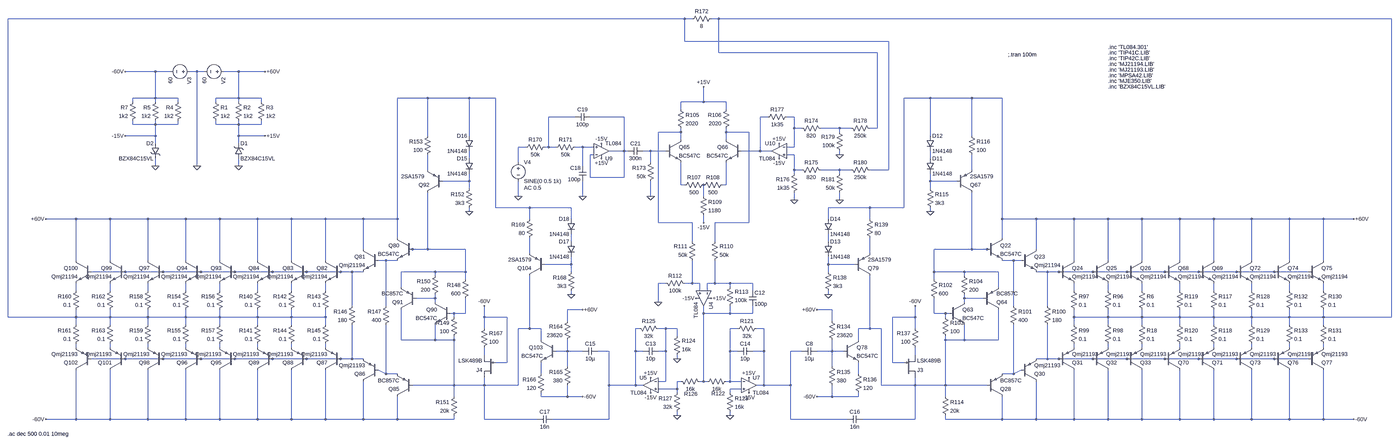
[diagram p0: schematic testV9_3.asc, whole sheet]
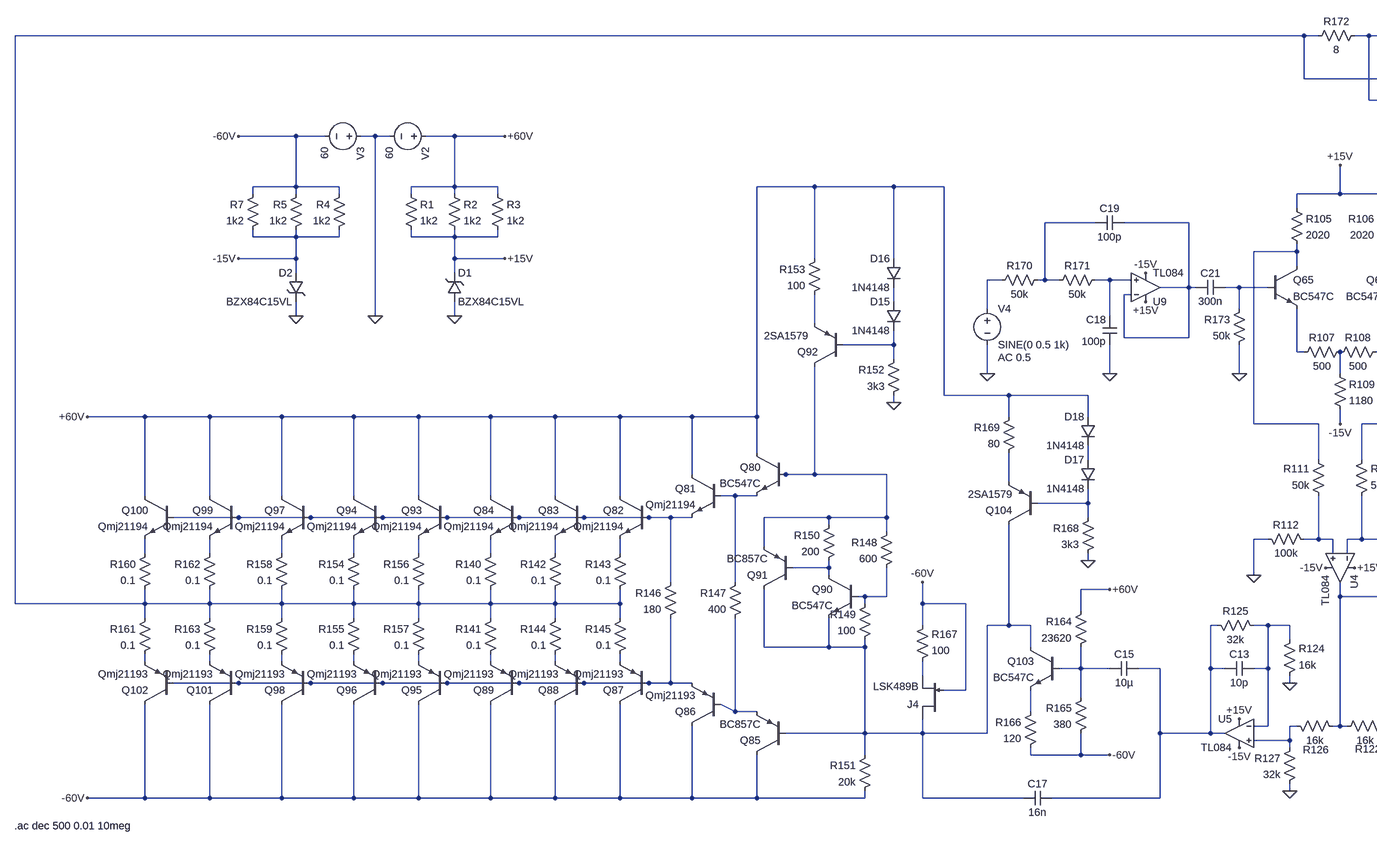
[diagram p1: schematic testV9_3.asc, part, row 1 of 1, column 1 of 2]
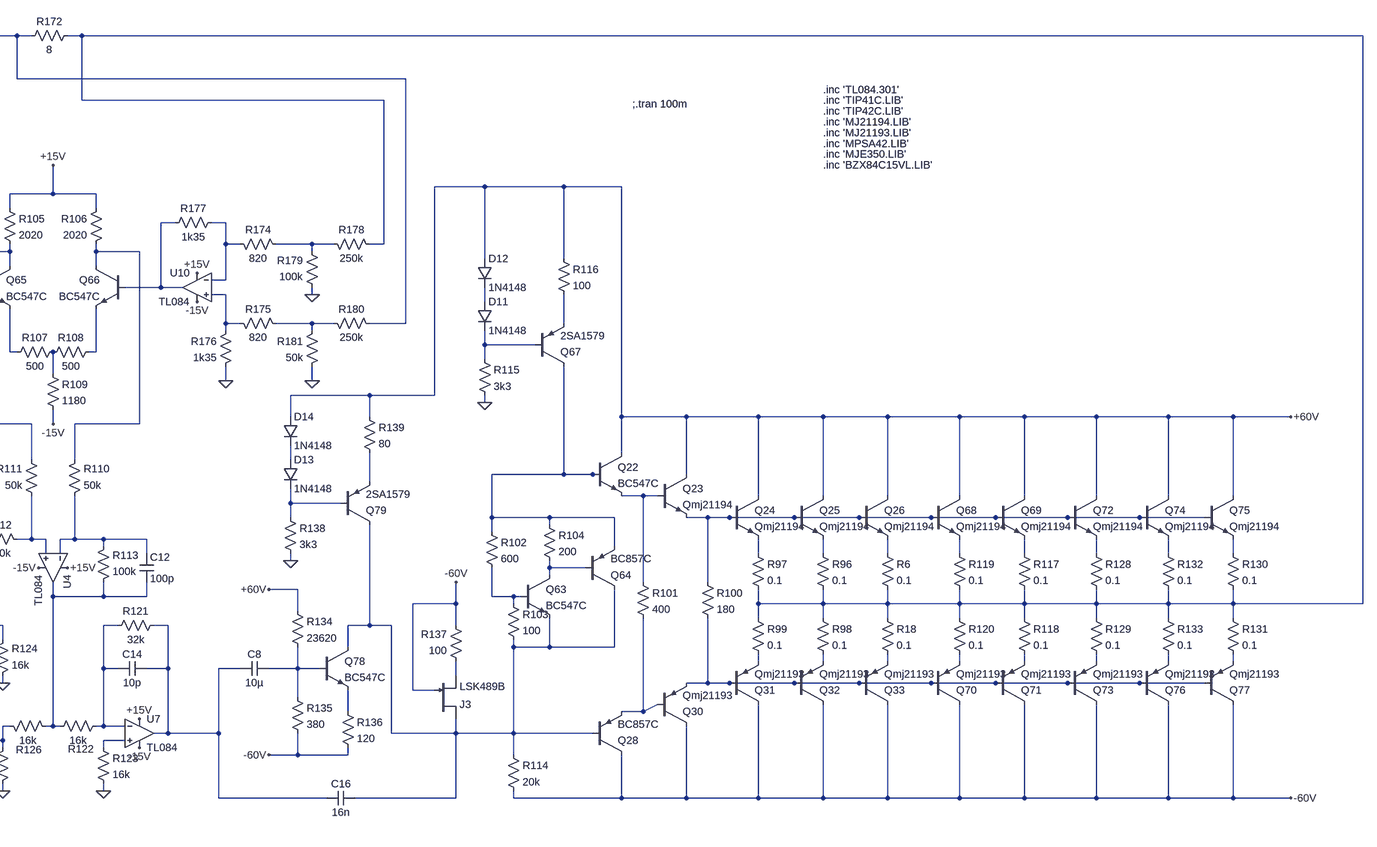
[diagram p2: schematic testV9_3.asc, part, row 1 of 1, column 2 of 2]
testV9_3.asc, the LTspice schematic file:
Version 4
SHEET 1 16980 7392
WIRE 7632 4208 4768 4208
WIRE 7664 4208 7632 4208
WIRE 7776 4208 7744 4208
WIRE 10624 4208 7776 4208
WIRE 7632 4304 7632 4208
WIRE 8496 4304 7632 4304
WIRE 7776 4352 7776 4208
WIRE 8448 4352 7776 4352
WIRE 5392 4432 5264 4432
WIRE 5456 4432 5392 4432
WIRE 5568 4432 5536 4432
WIRE 5600 4432 5568 4432
WIRE 5744 4432 5680 4432
WIRE 5856 4432 5744 4432
WIRE 5392 4544 5392 4432
WIRE 5392 4544 5296 4544
WIRE 5488 4544 5392 4544
WIRE 5744 4544 5744 4432
WIRE 5744 4544 5648 4544
WIRE 5840 4544 5744 4544
WIRE 6544 4544 6416 4544
WIRE 6720 4544 6544 4544
WIRE 6832 4544 6720 4544
WIRE 8672 4544 8560 4544
WIRE 8848 4544 8672 4544
WIRE 8976 4544 8848 4544
WIRE 5296 4560 5296 4544
WIRE 5392 4560 5392 4544
WIRE 5488 4560 5488 4544
WIRE 5648 4560 5648 4544
WIRE 5744 4560 5744 4544
WIRE 5840 4560 5840 4544
WIRE 7712 4560 7712 4496
WIRE 7712 4560 7616 4560
WIRE 7808 4560 7712 4560
WIRE 7616 4592 7616 4560
WIRE 7808 4592 7808 4560
WIRE 7168 4624 7056 4624
WIRE 7376 4624 7232 4624
WIRE 7984 4624 7952 4624
WIRE 8096 4624 8064 4624
WIRE 5296 4656 5296 4640
WIRE 5392 4656 5392 4640
WIRE 5392 4656 5296 4656
WIRE 5488 4656 5488 4640
WIRE 5488 4656 5392 4656
WIRE 5648 4656 5648 4640
WIRE 5744 4656 5744 4640
WIRE 5744 4656 5648 4656
WIRE 5840 4656 5840 4640
WIRE 5840 4656 5744 4656
WIRE 8096 4672 8096 4624
WIRE 8128 4672 8096 4672
WIRE 8288 4672 8208 4672
WIRE 8336 4672 8288 4672
WIRE 8448 4672 8448 4352
WIRE 8448 4672 8416 4672
WIRE 7616 4688 7616 4672
WIRE 7616 4688 7520 4688
WIRE 7808 4688 7808 4672
WIRE 7904 4688 7808 4688
WIRE 8288 4688 8288 4672
WIRE 5392 4704 5392 4656
WIRE 5392 4704 5264 4704
WIRE 5744 4704 5744 4656
WIRE 5856 4704 5744 4704
WIRE 6544 4704 6544 4544
WIRE 6720 4704 6720 4544
WIRE 8672 4704 8672 4544
WIRE 8848 4704 8848 4544
WIRE 7616 4720 7616 4688
WIRE 7808 4720 7808 4688
WIRE 5392 4736 5392 4704
WIRE 5744 4736 5744 4704
WIRE 6960 4752 6928 4752
WIRE 7056 4752 7056 4624
WIRE 7056 4752 7040 4752
WIRE 7088 4752 7056 4752
WIRE 7200 4752 7168 4752
WIRE 7248 4752 7200 4752
WIRE 8096 4752 8096 4672
WIRE 8096 4752 8064 4752
WIRE 7376 4768 7376 4624
WIRE 7376 4768 7312 4768
WIRE 7392 4768 7376 4768
WIRE 7488 4768 7456 4768
WIRE 7552 4768 7488 4768
WIRE 7952 4768 7952 4624
WIRE 7952 4768 7872 4768
WIRE 8000 4768 7952 4768
WIRE 7248 4784 7232 4784
WIRE 8096 4784 8064 4784
WIRE 8288 4784 8288 4768
WIRE 6720 4800 6720 4768
WIRE 8672 4800 8672 4768
WIRE 6928 4816 6928 4752
WIRE 7488 4816 7488 4768
WIRE 5392 4832 5392 4800
WIRE 5568 4832 5568 4432
WIRE 5744 4832 5744 4800
WIRE 7200 4832 7200 4752
WIRE 6544 4848 6544 4784
WIRE 8096 4848 8096 4784
WIRE 8128 4848 8096 4848
WIRE 8288 4848 8208 4848
WIRE 8336 4848 8288 4848
WIRE 8496 4848 8496 4304
WIRE 8496 4848 8416 4848
WIRE 8848 4848 8848 4784
WIRE 8096 4864 8096 4848
WIRE 8288 4864 8288 4848
WIRE 7232 4880 7232 4784
WIRE 7376 4880 7376 4768
WIRE 7376 4880 7232 4880
WIRE 6720 4896 6720 4864
WIRE 6720 4896 6608 4896
WIRE 8672 4896 8672 4864
WIRE 8784 4896 8672 4896
WIRE 7616 4912 7616 4816
WIRE 7632 4912 7616 4912
WIRE 7808 4912 7808 4816
WIRE 7808 4912 7792 4912
WIRE 6720 4928 6720 4896
WIRE 8672 4928 8672 4896
WIRE 6928 4960 6928 4896
WIRE 7200 4960 7200 4896
WIRE 7488 4960 7488 4896
WIRE 7712 4960 7712 4912
WIRE 8096 4976 8096 4944
WIRE 8288 4976 8288 4944
WIRE 6832 5008 6832 4544
WIRE 6976 5008 6832 5008
WIRE 7152 5008 6976 5008
WIRE 8416 5008 8240 5008
WIRE 8560 5008 8560 4544
WIRE 8560 5008 8416 5008
WIRE 6720 5024 6720 5008
WIRE 8672 5024 8672 5008
WIRE 5056 5056 4928 5056
WIRE 5200 5056 5056 5056
WIRE 5360 5056 5200 5056
WIRE 5520 5056 5360 5056
WIRE 5664 5056 5520 5056
WIRE 5824 5056 5664 5056
WIRE 5968 5056 5824 5056
WIRE 6112 5056 5968 5056
WIRE 6272 5056 6112 5056
WIRE 6416 5056 6416 4544
WIRE 6416 5056 6272 5056
WIRE 6976 5056 6976 5008
WIRE 7152 5056 7152 5008
WIRE 8240 5056 8240 5008
WIRE 8416 5056 8416 5008
WIRE 8976 5056 8976 4544
WIRE 9120 5056 8976 5056
WIRE 9280 5056 9120 5056
WIRE 9424 5056 9280 5056
WIRE 9568 5056 9424 5056
WIRE 9728 5056 9568 5056
WIRE 9872 5056 9728 5056
WIRE 10032 5056 9872 5056
WIRE 10192 5056 10032 5056
WIRE 10336 5056 10192 5056
WIRE 10464 5056 10336 5056
WIRE 7520 5072 7520 4688
WIRE 7664 5072 7520 5072
WIRE 7712 5072 7712 5040
WIRE 7904 5072 7904 4688
WIRE 7904 5072 7760 5072
WIRE 6416 5136 6416 5056
WIRE 8976 5136 8976 5056
WIRE 7152 5152 7152 5120
WIRE 7664 5152 7664 5072
WIRE 7760 5152 7760 5072
WIRE 8240 5152 8240 5120
WIRE 6272 5184 6272 5056
WIRE 6480 5184 6464 5184
WIRE 6544 5184 6544 4944
WIRE 6544 5184 6480 5184
WIRE 6704 5184 6544 5184
WIRE 8848 5184 8848 4944
WIRE 8848 5184 8688 5184
WIRE 8912 5184 8848 5184
WIRE 8928 5184 8912 5184
WIRE 9120 5184 9120 5056
WIRE 6976 5200 6976 5136
WIRE 8416 5200 8416 5136
WIRE 5056 5232 5056 5056
WIRE 5200 5232 5200 5056
WIRE 5360 5232 5360 5056
WIRE 5520 5232 5520 5056
WIRE 5664 5232 5664 5056
WIRE 5824 5232 5824 5056
WIRE 5968 5232 5968 5056
WIRE 6112 5232 6112 5056
WIRE 6368 5232 6336 5232
WIRE 6416 5232 6368 5232
WIRE 9024 5232 8976 5232
WIRE 9056 5232 9024 5232
WIRE 9280 5232 9280 5056
WIRE 9424 5232 9424 5056
WIRE 9568 5232 9568 5056
WIRE 9728 5232 9728 5056
WIRE 9872 5232 9872 5056
WIRE 10032 5232 10032 5056
WIRE 10192 5232 10192 5056
WIRE 10336 5232 10336 5056
WIRE 7152 5248 7152 5216
WIRE 7152 5248 7040 5248
WIRE 8240 5248 8240 5216
WIRE 8352 5248 8240 5248
WIRE 5264 5280 5120 5280
WIRE 5424 5280 5264 5280
WIRE 5584 5280 5424 5280
WIRE 5728 5280 5584 5280
WIRE 5888 5280 5728 5280
WIRE 6032 5280 5888 5280
WIRE 6176 5280 6032 5280
WIRE 6224 5280 6176 5280
WIRE 6272 5280 6224 5280
WIRE 6576 5280 6432 5280
WIRE 6704 5280 6704 5184
WIRE 6704 5280 6576 5280
WIRE 7152 5280 7152 5248
WIRE 8240 5280 8240 5248
WIRE 8688 5280 8688 5184
WIRE 8816 5280 8688 5280
WIRE 8960 5280 8816 5280
WIRE 9168 5280 9120 5280
WIRE 9216 5280 9168 5280
WIRE 9360 5280 9216 5280
WIRE 9504 5280 9360 5280
WIRE 9664 5280 9504 5280
WIRE 9808 5280 9664 5280
WIRE 9968 5280 9808 5280
WIRE 10128 5280 9968 5280
WIRE 10272 5280 10128 5280
WIRE 6576 5296 6576 5280
WIRE 8816 5296 8816 5280
WIRE 6704 5312 6704 5280
WIRE 8688 5312 8688 5280
WIRE 7552 5328 7520 5328
WIRE 7664 5328 7664 5232
WIRE 7664 5328 7632 5328
WIRE 7696 5328 7664 5328
WIRE 7760 5328 7760 5232
WIRE 7760 5328 7728 5328
WIRE 7824 5328 7760 5328
WIRE 7920 5328 7824 5328
WIRE 6432 5344 6432 5280
WIRE 7824 5344 7824 5328
WIRE 8960 5344 8960 5280
WIRE 5056 5360 5056 5328
WIRE 5200 5360 5200 5328
WIRE 5360 5360 5360 5328
WIRE 5520 5360 5520 5328
WIRE 5664 5360 5664 5328
WIRE 5824 5360 5824 5328
WIRE 5968 5360 5968 5328
WIRE 6112 5360 6112 5328
WIRE 7696 5360 7696 5328
WIRE 7728 5360 7728 5328
WIRE 7920 5360 7920 5328
WIRE 9280 5360 9280 5328
WIRE 9424 5360 9424 5328
WIRE 9568 5360 9568 5328
WIRE 9728 5360 9728 5328
WIRE 9872 5360 9872 5328
WIRE 10032 5360 10032 5328
WIRE 10192 5360 10192 5328
WIRE 10336 5360 10336 5328
WIRE 7152 5376 7152 5360
WIRE 8240 5376 8240 5360
WIRE 6576 5392 6576 5376
WIRE 6576 5392 6496 5392
WIRE 8816 5392 8816 5376
WIRE 8896 5392 8816 5392
WIRE 6576 5408 6576 5392
WIRE 7520 5408 7520 5328
WIRE 8816 5408 8816 5392
WIRE 6224 5424 6224 5280
WIRE 6368 5424 6368 5232
WIRE 9024 5424 9024 5232
WIRE 9168 5424 9168 5280
WIRE 7200 5440 7136 5440
WIRE 8256 5440 8192 5440
WIRE 6656 5456 6640 5456
WIRE 6704 5456 6704 5392
WIRE 6704 5456 6656 5456
WIRE 7712 5456 7712 5424
WIRE 7824 5456 7824 5424
WIRE 7824 5456 7712 5456
WIRE 7920 5456 7920 5424
WIRE 7920 5456 7824 5456
WIRE 8688 5456 8688 5392
WIRE 8736 5456 8688 5456
WIRE 8752 5456 8736 5456
WIRE 4768 5472 4768 4208
WIRE 5056 5472 5056 5440
WIRE 5056 5472 4768 5472
WIRE 5200 5472 5200 5440
WIRE 5200 5472 5056 5472
WIRE 5360 5472 5360 5440
WIRE 5360 5472 5200 5472
WIRE 5520 5472 5520 5440
WIRE 5520 5472 5360 5472
WIRE 5664 5472 5664 5440
WIRE 5664 5472 5520 5472
WIRE 5824 5472 5824 5440
WIRE 5824 5472 5664 5472
WIRE 5968 5472 5968 5440
WIRE 5968 5472 5824 5472
WIRE 6112 5472 6112 5440
WIRE 6112 5472 5968 5472
WIRE 6656 5472 6656 5456
WIRE 6784 5472 6784 5424
WIRE 6880 5472 6784 5472
WIRE 8608 5472 8608 5424
WIRE 8608 5472 8512 5472
WIRE 8736 5472 8736 5456
WIRE 9280 5472 9280 5440
WIRE 9424 5472 9424 5440
WIRE 9424 5472 9280 5472
WIRE 9568 5472 9568 5440
WIRE 9568 5472 9424 5472
WIRE 9728 5472 9728 5440
WIRE 9728 5472 9568 5472
WIRE 9872 5472 9872 5440
WIRE 9872 5472 9728 5472
WIRE 10032 5472 10032 5440
WIRE 10032 5472 9872 5472
WIRE 10192 5472 10192 5440
WIRE 10192 5472 10032 5472
WIRE 10336 5472 10336 5440
WIRE 10336 5472 10192 5472
WIRE 10624 5472 10624 4208
WIRE 10624 5472 10336 5472
WIRE 7136 5488 7136 5440
WIRE 8256 5488 8256 5440
WIRE 5056 5504 5056 5472
WIRE 5200 5504 5200 5472
WIRE 5360 5504 5360 5472
WIRE 5520 5504 5520 5472
WIRE 5664 5504 5664 5472
WIRE 5824 5504 5824 5472
WIRE 5968 5504 5968 5472
WIRE 6112 5504 6112 5472
WIRE 9280 5504 9280 5472
WIRE 9424 5504 9424 5472
WIRE 9568 5504 9568 5472
WIRE 9728 5504 9728 5472
WIRE 9872 5504 9872 5472
WIRE 10032 5504 10032 5472
WIRE 10192 5504 10192 5472
WIRE 10336 5504 10336 5472
WIRE 6784 5520 6784 5472
WIRE 6976 5520 6976 5296
WIRE 6976 5520 6928 5520
WIRE 7024 5520 6976 5520
WIRE 7440 5520 7424 5520
WIRE 7552 5520 7520 5520
WIRE 7600 5520 7552 5520
WIRE 7856 5520 7824 5520
WIRE 7968 5520 7936 5520
WIRE 8416 5520 8416 5296
WIRE 8416 5520 8368 5520
WIRE 8464 5520 8416 5520
WIRE 8608 5520 8608 5472
WIRE 7600 5552 7600 5520
WIRE 6432 5568 6432 5440
WIRE 6576 5568 6576 5504
WIRE 6576 5568 6432 5568
WIRE 6656 5568 6656 5552
WIRE 6656 5568 6576 5568
WIRE 7024 5568 7024 5520
WIRE 8368 5568 8368 5520
WIRE 8736 5568 8736 5552
WIRE 8816 5568 8816 5504
WIRE 8816 5568 8736 5568
WIRE 8960 5568 8960 5440
WIRE 8960 5568 8816 5568
WIRE 5056 5600 5056 5584
WIRE 5200 5600 5200 5584
WIRE 5360 5600 5360 5584
WIRE 5520 5600 5520 5584
WIRE 5664 5600 5664 5584
WIRE 5824 5600 5824 5584
WIRE 5968 5600 5968 5584
WIRE 6112 5600 6112 5584
WIRE 9280 5600 9280 5584
WIRE 9424 5600 9424 5584
WIRE 9568 5600 9568 5584
WIRE 9728 5600 9728 5584
WIRE 9872 5600 9872 5584
WIRE 10032 5600 10032 5584
WIRE 10192 5600 10192 5584
WIRE 10336 5600 10336 5584
WIRE 7136 5616 7136 5568
WIRE 7136 5616 7088 5616
WIRE 7200 5616 7136 5616
WIRE 7312 5616 7264 5616
WIRE 7424 5616 7424 5520
WIRE 7456 5616 7424 5616
WIRE 7552 5616 7552 5520
WIRE 7552 5616 7520 5616
WIRE 7824 5616 7824 5520
WIRE 7856 5616 7824 5616
WIRE 7968 5616 7968 5520
WIRE 7968 5616 7920 5616
WIRE 8128 5616 8080 5616
WIRE 8256 5616 8256 5568
WIRE 8256 5616 8192 5616
WIRE 8304 5616 8256 5616
WIRE 6784 5632 6784 5600
WIRE 8608 5632 8608 5600
WIRE 5264 5648 5120 5648
WIRE 5424 5648 5264 5648
WIRE 5584 5648 5424 5648
WIRE 5728 5648 5584 5648
WIRE 5888 5648 5728 5648
WIRE 6032 5648 5888 5648
WIRE 6176 5648 6032 5648
WIRE 6224 5648 6224 5504
WIRE 6224 5648 6176 5648
WIRE 6272 5648 6224 5648
WIRE 7600 5648 7600 5632
WIRE 9168 5648 9168 5504
WIRE 9168 5648 9120 5648
WIRE 9216 5648 9168 5648
WIRE 9360 5648 9216 5648
WIRE 9504 5648 9360 5648
WIRE 9664 5648 9504 5648
WIRE 9808 5648 9664 5648
WIRE 9968 5648 9808 5648
WIRE 10128 5648 9968 5648
WIRE 10272 5648 10128 5648
WIRE 6880 5664 6880 5472
WIRE 6880 5664 6832 5664
WIRE 8512 5664 8512 5472
WIRE 8560 5664 8512 5664
WIRE 7136 5680 7136 5616
WIRE 8256 5680 8256 5616
WIRE 6368 5712 6368 5504
WIRE 6368 5712 6336 5696
WIRE 6416 5712 6368 5712
WIRE 7024 5712 7024 5664
WIRE 8368 5712 8368 5664
WIRE 9024 5712 9024 5504
WIRE 9024 5712 9056 5696
WIRE 9024 5712 8976 5712
WIRE 7552 5744 7552 5616
WIRE 7552 5744 7520 5744
WIRE 7616 5744 7600 5744
WIRE 7712 5744 7712 5456
WIRE 7712 5744 7696 5744
WIRE 7728 5744 7712 5744
WIRE 7824 5744 7824 5616
WIRE 7824 5744 7808 5744
WIRE 7872 5744 7824 5744
WIRE 6656 5760 6656 5568
WIRE 6656 5760 6480 5760
WIRE 6784 5760 6784 5728
WIRE 6784 5760 6656 5760
WIRE 6928 5760 6928 5520
WIRE 6928 5760 6784 5760
WIRE 7312 5760 7312 5616
WIRE 7424 5760 7424 5616
WIRE 7424 5760 7312 5760
WIRE 7456 5760 7424 5760
WIRE 7968 5760 7968 5616
WIRE 7968 5760 7936 5760
WIRE 8080 5760 8080 5616
WIRE 8080 5760 7968 5760
WIRE 8464 5760 8464 5520
WIRE 8608 5760 8608 5728
WIRE 8608 5760 8464 5760
WIRE 8736 5760 8736 5568
WIRE 8736 5760 8608 5760
WIRE 8912 5760 8736 5760
WIRE 7600 5776 7600 5744
WIRE 7600 5776 7520 5776
WIRE 7872 5776 7824 5776
WIRE 7600 5792 7600 5776
WIRE 7824 5792 7824 5776
WIRE 6656 5808 6656 5760
WIRE 7024 5808 7024 5792
WIRE 7136 5808 7136 5760
WIRE 7136 5808 7024 5808
WIRE 7200 5808 7136 5808
WIRE 8256 5808 8256 5760
WIRE 8256 5808 8192 5808
WIRE 8368 5808 8368 5792
WIRE 8368 5808 8256 5808
WIRE 8736 5808 8736 5760
WIRE 7600 5888 7600 5872
WIRE 7824 5888 7824 5872
WIRE 5056 5904 5056 5696
WIRE 5056 5904 4928 5904
WIRE 5200 5904 5200 5696
WIRE 5200 5904 5056 5904
WIRE 5360 5904 5360 5696
WIRE 5360 5904 5200 5904
WIRE 5520 5904 5520 5696
WIRE 5520 5904 5360 5904
WIRE 5664 5904 5664 5696
WIRE 5664 5904 5520 5904
WIRE 5824 5904 5824 5696
WIRE 5824 5904 5664 5904
WIRE 5968 5904 5968 5696
WIRE 5968 5904 5824 5904
WIRE 6112 5904 6112 5696
WIRE 6112 5904 5968 5904
WIRE 6272 5904 6272 5744
WIRE 6272 5904 6112 5904
WIRE 6416 5904 6416 5808
WIRE 6416 5904 6272 5904
WIRE 6656 5904 6656 5888
WIRE 6656 5904 6416 5904
WIRE 6784 5904 6784 5760
WIRE 7008 5904 6784 5904
WIRE 7312 5904 7312 5760
WIRE 7312 5904 7072 5904
WIRE 8080 5904 8080 5760
WIRE 8320 5904 8080 5904
WIRE 8608 5904 8608 5760
WIRE 8608 5904 8384 5904
WIRE 8736 5904 8736 5888
WIRE 8976 5904 8976 5808
WIRE 8976 5904 8736 5904
WIRE 9120 5904 9120 5744
WIRE 9120 5904 8976 5904
WIRE 9280 5904 9280 5696
WIRE 9280 5904 9120 5904
WIRE 9424 5904 9424 5696
WIRE 9424 5904 9280 5904
WIRE 9568 5904 9568 5696
WIRE 9568 5904 9424 5904
WIRE 9728 5904 9728 5696
WIRE 9728 5904 9568 5904
WIRE 9872 5904 9872 5696
WIRE 9872 5904 9728 5904
WIRE 10032 5904 10032 5696
WIRE 10032 5904 9872 5904
WIRE 10192 5904 10192 5696
WIRE 10192 5904 10032 5904
WIRE 10336 5904 10336 5696
WIRE 10336 5904 10192 5904
WIRE 10464 5904 10336 5904
FLAG 5568 4832 0
FLAG 5856 4432 +60V
FLAG 5264 4432 -60V
FLAG 7712 5072 -15V
FLAG 7680 5392 -15V
FLAG 7712 4496 +15V
FLAG 7744 5392 +15V
FLAG 8672 5024 0
FLAG 7520 5408 0
FLAG 7824 5888 0
FLAG 7600 5648 0
FLAG 7600 5888 0
FLAG 7904 5792 -15V
FLAG 7488 5792 -15V
FLAG 7488 5728 +15V
FLAG 7904 5728 +15V
FLAG 8192 5440 +60V
FLAG 8192 5808 -60V
FLAG 8240 5376 0
FLAG 10464 5904 -60V
FLAG 10464 5056 +60V
FLAG 6720 5024 0
FLAG 7200 5440 +60V
FLAG 7200 5808 -60V
FLAG 7152 5376 0
FLAG 4928 5904 -60V
FLAG 4928 5056 +60V
FLAG 6928 4960 0
FLAG 7200 4960 0
FLAG 7280 4800 +15V
FLAG 7280 4736 -15V
FLAG 7488 4960 0
FLAG 8032 4800 -15V
FLAG 8032 4736 +15V
FLAG 8288 4784 0
FLAG 8288 4976 0
FLAG 8096 4976 0
FLAG 8608 5424 -60V
FLAG 6784 5424 -60V
FLAG 5744 4832 0
FLAG 5392 4832 0
FLAG 5856 4704 +15V
FLAG 5264 4704 -15V
SYMBOL voltage 5696 4432 R90
WINDOW 123 0 0 Left 0
WINDOW 39 24 44 Left 2
SYMATTR InstName V2
SYMATTR Value 60
SYMBOL voltage 5552 4432 R90
WINDOW 123 0 0 Left 0
WINDOW 39 24 124 Left 2
SYMATTR InstName V3
SYMATTR Value 60
SYMBOL npn 8912 5136 R0
SYMATTR InstName Q22
SYMATTR Value BC547C
SYMBOL npn 9056 5184 R0
SYMATTR InstName Q23
SYMATTR Value Qmj21194
SYMBOL npn 9216 5232 R0
SYMATTR InstName Q24
SYMATTR Value Qmj21194
SYMBOL npn 9360 5232 R0
SYMATTR InstName Q25
SYMATTR Value Qmj21194
SYMBOL npn 9504 5232 R0
SYMATTR InstName Q26
SYMATTR Value Qmj21194
SYMBOL pnp 8912 5808 M180
SYMATTR InstName Q28
SYMATTR Value BC857C
SYMBOL pnp 9056 5744 M180
SYMATTR InstName Q30
SYMATTR Value Qmj21193
SYMBOL pnp 9216 5696 M180
SYMATTR InstName Q31
SYMATTR Value Qmj21193
SYMBOL pnp 9360 5696 M180
SYMATTR InstName Q32
SYMATTR Value Qmj21193
SYMBOL pnp 9504 5696 M180
SYMATTR InstName Q33
SYMATTR Value Qmj21193
SYMBOL res 9552 5344 R0
SYMATTR InstName R6
SYMATTR Value 0.1
SYMBOL res 9552 5488 R0
SYMATTR InstName R18
SYMATTR Value 0.1
SYMBOL res 9408 5344 R0
SYMATTR InstName R96
SYMATTR Value 0.1
SYMBOL res 9264 5344 R0
SYMATTR InstName R97
SYMATTR Value 0.1
SYMBOL res 9408 5488 R0
SYMATTR InstName R98
SYMATTR Value 0.1
SYMBOL res 9264 5488 R0
SYMATTR InstName R99
SYMATTR Value 0.1
SYMBOL res 9152 5408 R0
SYMATTR InstName R100
SYMATTR Value 180
SYMBOL res 9008 5408 R0
SYMATTR InstName R101
SYMATTR Value 400
SYMBOL npn 8752 5408 R0
SYMATTR InstName Q63
SYMATTR Value BC547C
SYMBOL res 8672 5296 R0
SYMATTR InstName R102
SYMATTR Value 600
SYMBOL res 8720 5456 R0
SYMATTR InstName R103
SYMATTR Value 100
SYMBOL res 8800 5280 R0
SYMATTR InstName R104
SYMATTR Value 200
SYMBOL pnp 8896 5440 M180
SYMATTR InstName Q64
SYMATTR Value BC857C
SYMBOL npn 7552 4720 R0
SYMATTR InstName Q65
SYMATTR Value BC547C
SYMBOL npn 7872 4720 M0
SYMATTR InstName Q66
SYMATTR Value BC547C
SYMBOL res 7600 4576 R0
SYMATTR InstName R105
SYMATTR Value 2020
SYMBOL res 7824 4576 M0
SYMATTR InstName R106
SYMATTR Value 2020
SYMBOL res 7728 4896 R90
WINDOW 0 0 56 VBottom 2
WINDOW 3 32 56 VTop 2
SYMATTR InstName R107
SYMATTR Value 500
SYMBOL res 7808 4896 R90
WINDOW 0 0 56 VBottom 2
WINDOW 3 32 56 VTop 2
SYMATTR InstName R108
SYMATTR Value 500
SYMBOL res 7696 4944 R0
SYMATTR InstName R109
SYMATTR Value 1180
SYMBOL Opamps\\opamp2 7776 5392 R90
SYMATTR InstName U4
SYMATTR Value TL084
SYMBOL res 7744 5248 M180
WINDOW 0 36 76 Left 2
WINDOW 3 36 40 Left 2
SYMATTR InstName R110
SYMATTR Value 50k
SYMBOL res 7680 5248 R180
WINDOW 0 36 76 Left 2
WINDOW 3 36 40 Left 2
SYMATTR InstName R111
SYMATTR Value 50k
SYMBOL res 7648 5344 M270
WINDOW 0 32 56 VTop 2
WINDOW 3 0 56 VBottom 2
SYMATTR InstName R112
SYMATTR Value 100k
SYMBOL res 7808 5440 M180
WINDOW 0 36 76 Left 2
WINDOW 3 36 40 Left 2
SYMATTR InstName R113
SYMATTR Value 100k
SYMBOL res 8720 5792 R0
SYMATTR InstName R114
SYMATTR Value 20k
SYMBOL pnp 8784 4944 M180
SYMATTR InstName Q67
SYMATTR Value 2SA1579
SYMBOL res 8656 4912 R0
SYMATTR InstName R115
SYMATTR Value 3k3
SYMBOL diode 8656 4800 R0
SYMATTR InstName D11
SYMATTR Value 1N4148
SYMBOL diode 8656 4704 R0
SYMATTR InstName D12
SYMATTR Value 1N4148
SYMBOL res 8832 4688 R0
SYMATTR InstName R116
SYMATTR Value 100
SYMBOL npn 9664 5232 R0
SYMATTR InstName Q68
SYMATTR Value Qmj21194
SYMBOL npn 9808 5232 R0
SYMATTR InstName Q69
SYMATTR Value Qmj21194
SYMBOL pnp 9664 5696 M180
SYMATTR InstName Q70
SYMATTR Value Qmj21193
SYMBOL pnp 9808 5696 M180
SYMATTR InstName Q71
SYMATTR Value Qmj21193
SYMBOL res 9856 5344 R0
SYMATTR InstName R117
SYMATTR Value 0.1
SYMBOL res 9856 5488 R0
SYMATTR InstName R118
SYMATTR Value 0.1
SYMBOL res 9712 5344 R0
SYMATTR InstName R119
SYMATTR Value 0.1
SYMBOL res 9712 5488 R0
SYMATTR InstName R120
SYMATTR Value 0.1
SYMBOL res 7952 5504 R90
WINDOW 0 0 56 VBottom 2
WINDOW 3 32 56 VTop 2
SYMATTR InstName R121
SYMATTR Value 32k
SYMBOL res 7824 5728 R90
WINDOW 0 83 50 VBottom 2
WINDOW 3 32 56 VTop 2
SYMATTR InstName R122
SYMATTR Value 16k
SYMBOL res 7808 5776 R0
SYMATTR InstName R123
SYMATTR Value 16k
SYMBOL res 7584 5648 M180
WINDOW 0 36 76 Left 2
WINDOW 3 36 40 Left 2
SYMATTR InstName R124
SYMATTR Value 16k
SYMBOL res 7424 5504 M90
WINDOW 0 0 56 VBottom 2
WINDOW 3 32 56 VTop 2
SYMATTR InstName R125
SYMATTR Value 32k
SYMBOL res 7712 5760 M270
WINDOW 0 -52 54 VTop 2
WINDOW 3 0 56 VBottom 2
SYMATTR InstName R126
SYMATTR Value 16k
SYMBOL res 7616 5776 M0
SYMATTR InstName R127
SYMATTR Value 32k
SYMBOL npn 9968 5232 R0
SYMATTR InstName Q72
SYMATTR Value Qmj21194
SYMBOL pnp 9968 5696 M180
SYMATTR InstName Q73
SYMATTR Value Qmj21193
SYMBOL res 10016 5344 R0
SYMATTR InstName R128
SYMATTR Value 0.1
SYMBOL res 10016 5488 R0
SYMATTR InstName R129
SYMATTR Value 0.1
SYMBOL npn 10128 5232 R0
SYMATTR InstName Q74
SYMATTR Value Qmj21194
SYMBOL npn 10272 5232 R0
SYMATTR InstName Q75
SYMATTR Value Qmj21194
SYMBOL pnp 10128 5696 M180
SYMATTR InstName Q76
SYMATTR Value Qmj21193
SYMBOL pnp 10272 5696 M180
SYMATTR InstName Q77
SYMATTR Value Qmj21193
SYMBOL res 10320 5344 R0
SYMATTR InstName R130
SYMATTR Value 0.1
SYMBOL res 10320 5488 R0
SYMATTR InstName R131
SYMATTR Value 0.1
SYMBOL res 10176 5344 R0
SYMATTR InstName R132
SYMATTR Value 0.1
SYMBOL res 10176 5488 R0
SYMATTR InstName R133
SYMATTR Value 0.1
SYMBOL Opamps\\opamp2 7488 5696 M0
SYMATTR InstName U5
SYMATTR Value TL084
SYMBOL Opamps\\opamp2 7904 5696 R0
SYMATTR InstName U7
SYMATTR Value TL084
SYMBOL cap 8192 5600 R90
WINDOW 0 0 32 VBottom 2
WINDOW 3 32 32 VTop 2
SYMATTR InstName C8
SYMATTR Value 10µ
SYMATTR SpiceLine Rser=0.1
SYMBOL res 8240 5472 R0
SYMATTR InstName R134
SYMATTR Value 23620
SYMBOL res 8240 5664 R0
SYMATTR InstName R135
SYMATTR Value 380
SYMBOL npn 8304 5568 R0
SYMATTR InstName Q78
SYMATTR Value BC547C
SYMBOL res 8352 5696 R0
SYMATTR InstName R136
SYMATTR Value 120
SYMBOL cap 7904 5360 R0
SYMATTR InstName C12
SYMATTR Value 100p
SYMATTR SpiceLine Rser=0.1
SYMBOL cap 7520 5600 R90
WINDOW 0 0 32 VBottom 2
WINDOW 3 32 32 VTop 2
SYMATTR InstName C13
SYMATTR Value 10p
SYMATTR SpiceLine Rser=0.1
SYMBOL cap 7920 5600 R90
WINDOW 0 0 32 VBottom 2
WINDOW 3 32 32 VTop 2
SYMATTR InstName C14
SYMATTR Value 10p
SYMATTR SpiceLine Rser=0.1
SYMBOL njf 8560 5728 M180
SYMATTR InstName J3
SYMATTR Value LSK489B
SYMBOL res 8624 5616 R180
WINDOW 0 36 76 Left 2
WINDOW 3 36 40 Left 2
SYMATTR InstName R137
SYMATTR Value 100
SYMBOL pnp 8352 5296 M180
SYMATTR InstName Q79
SYMATTR Value 2SA1579
SYMBOL res 8224 5264 R0
SYMATTR InstName R138
SYMATTR Value 3k3
SYMBOL diode 8224 5152 R0
SYMATTR InstName D13
SYMATTR Value 1N4148
SYMBOL diode 8224 5056 R0
SYMATTR InstName D14
SYMATTR Value 1N4148
SYMBOL res 8400 5040 R0
SYMATTR InstName R139
SYMATTR Value 80
SYMBOL cap 8384 5888 R90
WINDOW 0 0 32 VBottom 2
WINDOW 3 32 32 VTop 2
SYMATTR InstName C16
SYMATTR Value 16n
SYMATTR SpiceLine Rser=0.1
SYMBOL npn 6480 5136 M0
SYMATTR InstName Q80
SYMATTR Value BC547C
SYMBOL npn 6336 5184 M0
SYMATTR InstName Q81
SYMATTR Value Qmj21194
SYMBOL npn 6176 5232 M0
SYMATTR InstName Q82
SYMATTR Value Qmj21194
SYMBOL npn 6032 5232 M0
SYMATTR InstName Q83
SYMATTR Value Qmj21194
SYMBOL npn 5888 5232 M0
SYMATTR InstName Q84
SYMATTR Value Qmj21194
SYMBOL pnp 6480 5808 R180
SYMATTR InstName Q85
SYMATTR Value BC857C
SYMBOL pnp 6336 5744 R180
SYMATTR InstName Q86
SYMATTR Value Qmj21193
SYMBOL pnp 6176 5696 R180
SYMATTR InstName Q87
SYMATTR Value Qmj21193
SYMBOL pnp 6032 5696 R180
SYMATTR InstName Q88
SYMATTR Value Qmj21193
SYMBOL pnp 5888 5696 R180
SYMATTR InstName Q89
SYMATTR Value Qmj21193
SYMBOL res 5840 5344 M0
SYMATTR InstName R140
SYMATTR Value 0.1
SYMBOL res 5840 5488 M0
SYMATTR InstName R141
SYMATTR Value 0.1
SYMBOL res 5984 5344 M0
SYMATTR InstName R142
SYMATTR Value 0.1
SYMBOL res 6128 5344 M0
SYMATTR InstName R143
SYMATTR Value 0.1
SYMBOL res 5984 5488 M0
SYMATTR InstName R144
SYMATTR Value 0.1
SYMBOL res 6128 5488 M0
SYMATTR InstName R145
SYMATTR Value 0.1
SYMBOL res 6240 5408 M0
SYMATTR InstName R146
SYMATTR Value 180
SYMBOL res 6384 5408 M0
SYMATTR InstName R147
SYMATTR Value 400
SYMBOL npn 6640 5408 M0
SYMATTR InstName Q90
SYMATTR Value BC547C
SYMBOL res 6720 5296 M0
SYMATTR InstName R148
SYMATTR Value 600
SYMBOL res 6672 5456 M0
SYMATTR InstName R149
SYMATTR Value 100
SYMBOL res 6592 5280 M0
SYMATTR InstName R150
SYMATTR Value 200
SYMBOL pnp 6496 5440 R180
SYMATTR InstName Q91
SYMATTR Value BC857C
SYMBOL res 6672 5792 M0
SYMATTR InstName R151
SYMATTR Value 20k
SYMBOL pnp 6608 4944 R180
WINDOW 3 77 68 Left 2
SYMATTR Value 2SA1579
SYMATTR InstName Q92
SYMBOL res 6736 4912 M0
SYMATTR InstName R152
SYMATTR Value 3k3
SYMBOL diode 6736 4800 M0
SYMATTR InstName D15
SYMATTR Value 1N4148
SYMBOL diode 6736 4704 M0
SYMATTR InstName D16
SYMATTR Value 1N4148
SYMBOL res 6560 4688 M0
SYMATTR InstName R153
SYMATTR Value 100
SYMBOL npn 5728 5232 M0
SYMATTR InstName Q93
SYMATTR Value Qmj21194
SYMBOL npn 5584 5232 M0
SYMATTR InstName Q94
SYMATTR Value Qmj21194
SYMBOL pnp 5728 5696 R180
SYMATTR InstName Q95
SYMATTR Value Qmj21193
SYMBOL pnp 5584 5696 R180
SYMATTR InstName Q96
SYMATTR Value Qmj21193
SYMBOL res 5536 5344 M0
SYMATTR InstName R154
SYMATTR Value 0.1
SYMBOL res 5536 5488 M0
SYMATTR InstName R155
SYMATTR Value 0.1
SYMBOL res 5680 5344 M0
SYMATTR InstName R156
SYMATTR Value 0.1
SYMBOL res 5680 5488 M0
SYMATTR InstName R157
SYMATTR Value 0.1
SYMBOL npn 5424 5232 M0
SYMATTR InstName Q97
SYMATTR Value Qmj21194
SYMBOL pnp 5424 5696 R180
SYMATTR InstName Q98
SYMATTR Value Qmj21193
SYMBOL res 5376 5344 M0
SYMATTR InstName R158
SYMATTR Value 0.1
SYMBOL res 5376 5488 M0
SYMATTR InstName R159
SYMATTR Value 0.1
SYMBOL npn 5264 5232 M0
SYMATTR InstName Q99
SYMATTR Value Qmj21194
SYMBOL npn 5120 5232 M0
SYMATTR InstName Q100
SYMATTR Value Qmj21194
SYMBOL pnp 5264 5696 R180
SYMATTR InstName Q101
SYMATTR Value Qmj21193
SYMBOL pnp 5120 5696 R180
SYMATTR InstName Q102
SYMATTR Value Qmj21193
SYMBOL res 5072 5344 M0
SYMATTR InstName R160
SYMATTR Value 0.1
SYMBOL res 5072 5488 M0
SYMATTR InstName R161
SYMATTR Value 0.1
SYMBOL res 5216 5344 M0
SYMATTR InstName R162
SYMATTR Value 0.1
SYMBOL res 5216 5488 M0
SYMATTR InstName R163
SYMATTR Value 0.1
SYMBOL cap 7200 5600 M90
WINDOW 0 0 32 VBottom 2
WINDOW 3 32 32 VTop 2
SYMATTR InstName C15
SYMATTR Value 10µ
SYMATTR SpiceLine Rser=0.1
SYMBOL res 7152 5472 M0
SYMATTR InstName R164
SYMATTR Value 23620
SYMBOL res 7152 5664 M0
SYMATTR InstName R165
SYMATTR Value 380
SYMBOL npn 7088 5568 M0
SYMATTR InstName Q103
SYMATTR Value BC547C
SYMBOL res 7040 5696 M0
SYMATTR InstName R166
SYMATTR Value 120
SYMBOL njf 6832 5728 R180
SYMATTR InstName J4
SYMATTR Value LSK489B
SYMBOL res 6768 5616 M180
WINDOW 0 36 76 Left 2
WINDOW 3 36 40 Left 2
SYMATTR InstName R167
SYMATTR Value 100
SYMBOL pnp 7040 5296 R180
SYMATTR InstName Q104
SYMATTR Value 2SA1579
SYMBOL res 7168 5264 M0
SYMATTR InstName R168
SYMATTR Value 3k3
SYMBOL diode 7168 5152 M0
SYMATTR InstName D17
SYMATTR Value 1N4148
SYMBOL diode 7168 5056 M0
SYMATTR InstName D18
SYMATTR Value 1N4148
SYMBOL res 6992 5040 M0
SYMATTR InstName R169
SYMATTR Value 80
SYMBOL cap 7008 5888 M90
WINDOW 0 0 32 VBottom 2
WINDOW 3 32 32 VTop 2
SYMATTR InstName C17
SYMATTR Value 16n
SYMATTR SpiceLine Rser=0.1
SYMBOL Opamps\\opamp2 7280 4832 M180
SYMATTR InstName U9
SYMATTR Value TL084
SYMBOL res 7056 4736 R90
WINDOW 0 0 56 VBottom 2
WINDOW 3 32 56 VTop 2
SYMATTR InstName R170
SYMATTR Value 50k
SYMBOL res 7184 4736 R90
WINDOW 0 0 56 VBottom 2
WINDOW 3 32 56 VTop 2
SYMATTR InstName R171
SYMATTR Value 50k
SYMBOL cap 7216 4832 M0
SYMATTR InstName C18
SYMATTR Value 100p
SYMATTR SpiceLine Rser=0.1
SYMBOL cap 7232 4640 M270
WINDOW 0 32 32 VTop 2
WINDOW 3 0 32 VBottom 2
SYMATTR InstName C19
SYMATTR Value 100p
SYMATTR SpiceLine Rser=0.1
SYMBOL voltage 6928 4800 R0
WINDOW 123 24 124 Left 2
WINDOW 39 0 0 Left 0
SYMATTR Value2 AC 0.5
SYMATTR InstName V4
SYMATTR Value SINE(0 0.5 1k)
SYMBOL cap 7456 4752 R90
WINDOW 0 0 32 VBottom 2
WINDOW 3 32 32 VTop 2
SYMATTR InstName C21
SYMATTR Value 300n
SYMATTR SpiceLine Rser=0.1
SYMBOL res 7504 4800 M0
SYMATTR InstName R173
SYMATTR Value 50k
SYMBOL Opamps\\opamp2 8032 4704 M0
SYMATTR InstName U10
SYMATTR Value TL084
SYMBOL res 8112 4656 M90
WINDOW 0 0 56 VBottom 2
WINDOW 3 32 56 VTop 2
SYMATTR InstName R174
SYMATTR Value 820
SYMBOL res 8112 4832 M90
WINDOW 0 0 56 VBottom 2
WINDOW 3 32 56 VTop 2
SYMATTR InstName R175
SYMATTR Value 820
SYMBOL res 8112 4848 M0
SYMATTR InstName R176
SYMATTR Value 1k35
SYMBOL res 7968 4640 R270
WINDOW 0 32 56 VTop 2
WINDOW 3 0 56 VBottom 2
SYMATTR InstName R177
SYMATTR Value 1k35
SYMBOL res 8320 4656 M90
WINDOW 0 0 56 VBottom 2
WINDOW 3 32 56 VTop 2
SYMATTR InstName R178
SYMATTR Value 250k
SYMBOL res 8304 4784 R180
WINDOW 0 36 76 Left 2
WINDOW 3 36 40 Left 2
SYMATTR InstName R179
SYMATTR Value 100k
SYMBOL res 8432 4864 M270
WINDOW 0 32 56 VTop 2
WINDOW 3 0 56 VBottom 2
SYMATTR InstName R180
SYMATTR Value 250k
SYMBOL res 8304 4848 M0
SYMATTR InstName R181
SYMATTR Value 50k
SYMBOL res 7760 4192 R90
WINDOW 0 0 56 VBottom 2
WINDOW 3 32 56 VTop 2
SYMATTR InstName R172
SYMATTR Value 8
SYMBOL res 5632 4544 R0
SYMATTR InstName R1
SYMATTR Value 1k2
SYMBOL res 5728 4544 R0
SYMATTR InstName R2
SYMATTR Value 1k2
SYMBOL res 5824 4544 R0
SYMATTR InstName R3
SYMATTR Value 1k2
SYMBOL res 5504 4544 M0
SYMATTR InstName R4
SYMATTR Value 1k2
SYMBOL res 5408 4544 M0
SYMATTR InstName R5
SYMATTR Value 1k2
SYMBOL res 5312 4544 M0
SYMATTR InstName R7
SYMATTR Value 1k2
SYMBOL zener 5728 4800 M180
WINDOW 0 24 64 Left 2
WINDOW 3 24 0 Left 2
SYMATTR InstName D1
SYMATTR Value BZX84C15VL
SYMBOL zener 5408 4736 M0
SYMATTR InstName D2
SYMATTR Value BZX84C15VL
TEXT 9424 4328 Left 2 !.inc 'TL084.301'
TEXT 9424 4352 Left 2 !.inc 'TIP41C.LIB'
TEXT 9424 4376 Left 2 !.inc 'TIP42C.LIB'
TEXT 9424 4400 Left 2 !.inc 'MJ21194.LIB'
TEXT 9424 4424 Left 2 !.inc 'MJ21193.LIB'
TEXT 9424 4448 Left 2 !.inc 'MPSA42.LIB'
TEXT 9424 4472 Left 2 !.inc 'MJE350.LIB'
TEXT 9424 4496 Left 2 !.inc 'BZX84C15VL.LIB'
TEXT 9000 4360 Left 2 !;.tran 100m
TEXT 4766 5966 Left 2 !.ac dec 500 0.01 10meg

The netlist it stands for:
* testV9_3.asc
V2 +60V 0 60
V3 0 -60V 60
Q22 +60V N027 N031 0 BC547C
Q23 +60V N031 N035 0 Qmj21194
Q24 +60V N035 N046 0 Qmj21194
Q25 +60V N035 N047 0 Qmj21194
Q26 +60V N035 N048 0 Qmj21194
Q28 -60V N064 N090 0 BC857C
Q30 -60V N090 N086 0 Qmj21193
Q31 -60V N086 N073 0 Qmj21193
Q32 -60V N086 N074 0 Qmj21193
Q33 -60V N086 N075 0 Qmj21193
R6 N048 N002 0.1
R18 N002 N075 0.1
R96 N047 N002 0.1
R97 N046 N002 0.1
R98 N002 N074 0.1
R99 N002 N073 0.1
R100 N035 N086 180
R101 N031 N090 400
Q63 N055 N058 N064 0 BC547C
R102 N027 N058 600
R103 N058 N064 100
R104 N027 N055 200
Q64 N064 N055 N027 0 BC857C
Q65 N008 N012 N021 0 BC547C
Q66 N009 N005 N022 0 BC547C
R105 +15V N008 2020
R106 +15V N009 2020
R107 N023 N021 500
R108 N022 N023 500
R109 N023 -15V 1180
XU4 N036 N037 +15V -15V N057 TL084  ; pins In+ In- V+ V- OUT
R110 N037 N009 50k
R111 N036 N008 50k
R112 N036 0 100k
R113 N057 N037 100k
R114 N064 -60V 20k
Q67 N027 N020 N018 0 2SA1579
R115 N020 0 3k3
D11 N015 N020 1N4148
D12 +60V N015 1N4148
R116 +60V N018 100
Q68 +60V N035 N049 0 Qmj21194
Q69 +60V N035 N050 0 Qmj21194
Q70 -60V N086 N076 0 Qmj21193
Q71 -60V N086 N077 0 Qmj21193
R117 N050 N002 0.1
R118 N002 N077 0.1
R119 N049 N002 0.1
R120 N002 N076 0.1
R121 N063 N062 32k
R122 N062 N057 16k
R123 N092 0 16k
R124 0 N061 16k
R125 N060 N061 32k
R126 N057 N091 16k
R127 N091 0 32k
Q72 +60V N035 N051 0 Qmj21194
Q73 -60V N086 N078 0 Qmj21193
R128 N051 N002 0.1
R129 N002 N078 0.1
Q74 +60V N035 N052 0 Qmj21194
Q75 +60V N035 N053 0 Qmj21194
Q76 -60V N086 N079 0 Qmj21193
Q77 -60V N086 N080 0 Qmj21193
R130 N053 N002 0.1
R131 N002 N080 0.1
R132 N052 N002 0.1
R133 N002 N079 0.1
XU5 N091 N061 +15V -15V N060 TL084  ; pins In+ In- V+ V- OUT
XU7 N092 N062 +15V -15V N063 TL084  ; pins In+ In- V+ V- OUT
C8 N082 N063 10µ Rser=0.1
R134 +60V N082 23620
R135 N082 -60V 380
Q78 N064 N082 N089 0 BC547C
R136 N089 -60V 120
C12 N037 N057 100p Rser=0.1
C13 N061 N060 10p Rser=0.1
C14 N063 N062 10p Rser=0.1
J3 N064 -60V N084 LSK489B
R137 N084 -60V 100
Q79 N064 N033 N029 0 2SA1579
R138 N033 0 3k3
D13 N025 N033 1N4148
D14 +60V N025 1N4148
R139 +60V N029 80
C16 N064 N063 16n Rser=0.1
Q80 +60V N026 N030 0 BC547C
Q81 +60V N030 N034 0 Qmj21194
Q82 +60V N034 N045 0 Qmj21194
Q83 +60V N034 N044 0 Qmj21194
Q84 +60V N034 N043 0 Qmj21194
Q85 -60V N059 N087 0 BC857C
Q86 -60V N087 N085 0 Qmj21193
Q87 -60V N085 N072 0 Qmj21193
Q88 -60V N085 N071 0 Qmj21193
Q89 -60V N085 N070 0 Qmj21193
R140 N043 N001 0.1
R141 N001 N070 0.1
R142 N044 N001 0.1
R143 N045 N001 0.1
R144 N001 N071 0.1
R145 N001 N072 0.1
R146 N034 N085 180
R147 N030 N087 400
Q90 N054 N056 N059 0 BC547C
R148 N026 N056 600
R149 N056 N059 100
R150 N026 N054 200
Q91 N059 N054 N026 0 BC857C
R151 N059 -60V 20k
Q92 N026 N019 N016 0 2SA1579
R152 N019 0 3k3
D15 N014 N019 1N4148
D16 +60V N014 1N4148
R153 +60V N016 100
Q93 +60V N034 N042 0 Qmj21194
Q94 +60V N034 N041 0 Qmj21194
Q95 -60V N085 N069 0 Qmj21193
Q96 -60V N085 N068 0 Qmj21193
R154 N041 N001 0.1
R155 N001 N068 0.1
R156 N042 N001 0.1
R157 N001 N069 0.1
Q97 +60V N034 N040 0 Qmj21194
Q98 -60V N085 N067 0 Qmj21193
R158 N040 N001 0.1
R159 N001 N067 0.1
Q99 +60V N034 N039 0 Qmj21194
Q100 +60V N034 N038 0 Qmj21194
Q101 -60V N085 N066 0 Qmj21193
Q102 -60V N085 N065 0 Qmj21193
R160 N038 N001 0.1
R161 N001 N065 0.1
R162 N039 N001 0.1
R163 N001 N066 0.1
C15 N081 N060 10µ Rser=0.1
R164 +60V N081 23620
R165 N081 -60V 380
Q103 N059 N081 N088 0 BC547C
R166 N088 -60V 120
J4 N059 -60V N083 LSK489B
R167 N083 -60V 100
Q104 N059 N032 N028 0 2SA1579
R168 N032 0 3k3
D17 N024 N032 1N4148
D18 +60V N024 1N4148
R169 +60V N028 80
C17 N059 N060 16n Rser=0.1
XU9 N011 N004 +15V -15V N004 TL084  ; pins In+ In- V+ V- OUT
R170 N003 N010 50k
R171 N011 N003 50k
C18 N011 0 100p Rser=0.1
C19 N004 N003 100p Rser=0.1
V4 N010 0 SINE(0 0.5 1k) AC 0.5
C21 N012 N004 300n Rser=0.1
R173 N012 0 50k
XU10 N013 N006 +15V -15V N005 TL084  ; pins In+ In- V+ V- OUT
R174 N006 N007 820
R175 N013 N017 820
R176 N013 0 1k35
R177 N005 N006 1k35
R178 N007 N002 250k
R179 0 N007 100k
R180 N001 N017 250k
R181 N017 0 50k
R172 N002 N001 8
R1 +60V +15V 1k2
R2 +60V +15V 1k2
R3 +60V +15V 1k2
R4 -60V -15V 1k2
R5 -60V -15V 1k2
R7 -60V -15V 1k2
D1 0 +15V BZX84C15VL
D2 -15V 0 BZX84C15VL
.model D D
.lib standard.dio
.model NPN NPN
.model PNP PNP
.lib standard.bjt
.model NJF NJF
.model PJF PJF
.lib standard.jft
.inc 'TL084.301'
.inc 'TIP41C.LIB'
.inc 'TIP42C.LIB'
.inc 'MJ21194.LIB'
.inc 'MJ21193.LIB'
.inc 'MPSA42.LIB'
.inc 'MJE350.LIB'
.inc 'BZX84C15VL.LIB'
;.tran 100m
.ac dec 500 0.01 10meg
.backanno
.end